# EAGLE design Keg Cop - Daisy Chain T with Slots (EAGLE 9.5.2)
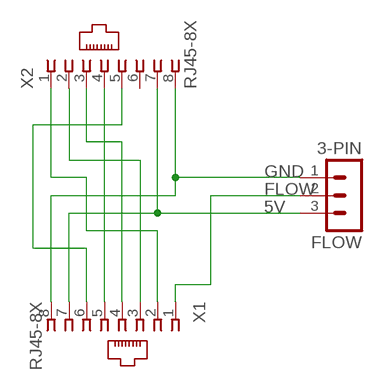
[diagram p0: schematic, sheet 1]

## Parts
FLOW  3-PIN  HDR-3  [HDR-3_VERT]
X1  RJ45-8X  [RJ45-NO-SHIELD]
X2  RJ45-8X  [RJ45-NO-SHIELD]

## Nets
5V: FLOW.3 X1.7 X2.7
FLOW: FLOW.2 X1.1
GND: FLOW.1 X1.8 X2.8
N$1: X1.2 X2.1
N$2: X1.3 X2.2
N$3: X1.4 X2.3
N$5: X1.5 X2.4
N$7: X1.6 X2.5
Unconnected: X2.6

## Library data of the parts
FLOW = Donnie:HDR-3: PIN HEADER
X1 X2 = con-tycoelectronics:RJ45: CORCOM Modular RJ Jacks No Shield Source: www.tycoelectronics.com .. ENG_DS_1654001_1099_RJ_L_0507.pdf; MPN: RJ45-8X; OC_FARNELL: unknown; OC_NEWARK: 16R6101

## Board
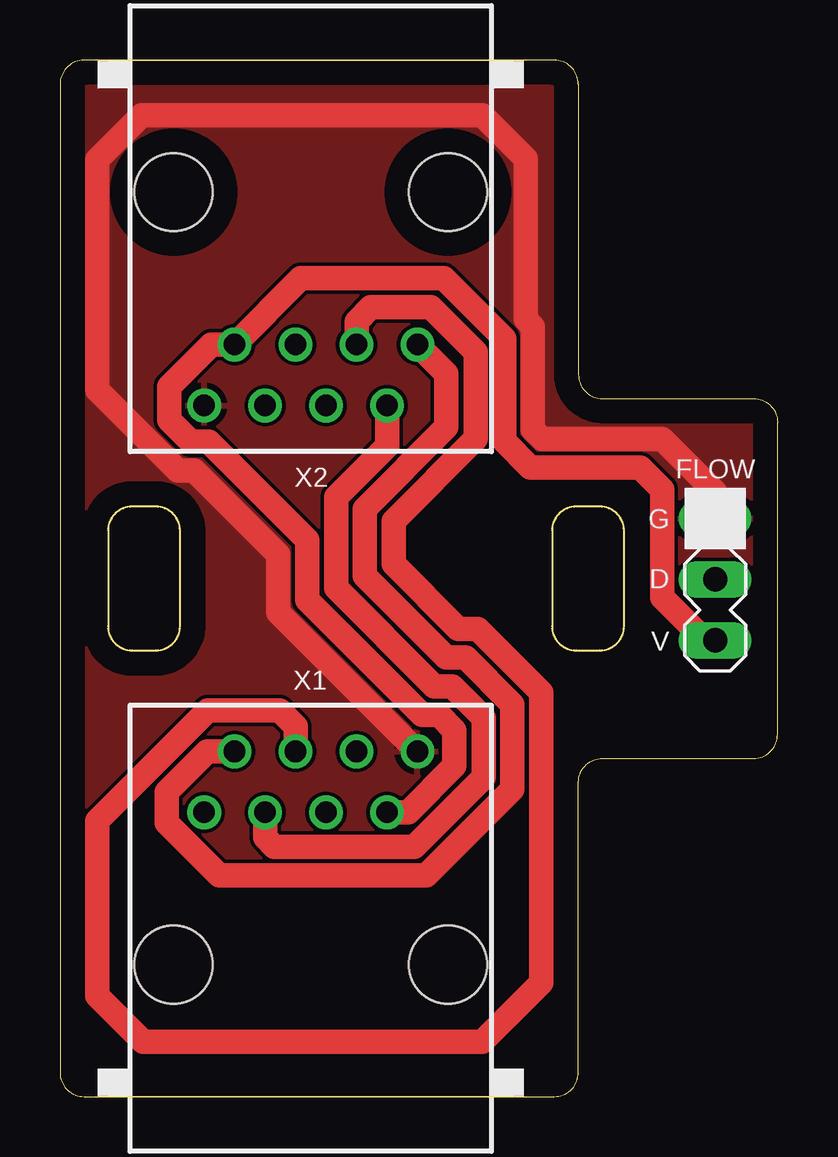
[diagram p1: board, top side]
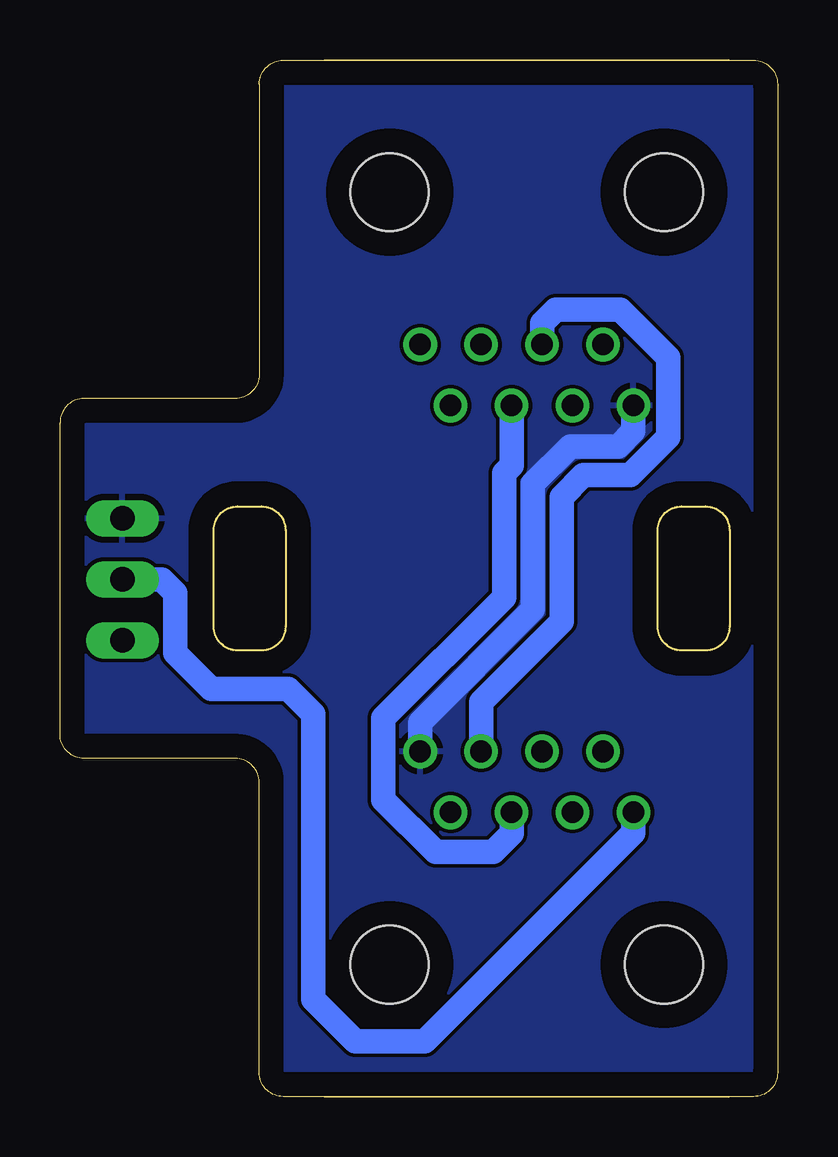
[diagram p2: board, bottom side, seen from below]

Size 29.9 x 43.22 mm. Coordinates in mm from the lower left corner, seen from the top.
Outline: 0,42.21 0,1.01 arc90 1,0.01 20.6,0.01 arc90 21.6,1.01 21.6,13.11 arc-90 22.6,14.11 28.9,14.11 arc90 29.9,15.11 29.9,28.11 arc90 28.9,29.11 22.6,29.11 arc-90 21.6,30.11 21.6,42.21 arc90 20.6,43.21 1,43.21 arc90 0,42.21
Outline: 4,24.61 3,24.61 arc90 2,23.61 2,19.61 arc90 3,18.61 4,18.61 arc90 5,19.61 5,23.61 arc90 4,24.61
Outline: 21.5,18.61 22.5,18.61 arc90 23.5,19.61 23.5,23.61 arc90 22.5,24.61 21.5,24.61 arc90 20.5,23.61 20.5,19.61 arc90 21.5,18.61
Copper layers (1*16): Top 0.035mm / dielectric 1.5mm / Bottom 0.035mm
Design rules "default": minimum track width 6mil, minimum drill 0.35mm, track to track 6mil, track to pad 6mil, pad to pad 6mil, via to via 6mil, smd to smd 6mil, copper to edge 40mil, drill to drill 6mil, minimum pad ring 10mil, minimum via ring 8mil, stop-mask expansion 4mil, vias tented up to drill 0mil, thermal gap 10mil

### Footprints (pad centres in the part's own frame; a part is rotated, then mirrored left to right if it is on the bottom)
HDR-3_VERT = drill 1.016 long: 1 0,0; 2 2.54,0; 3 5.08,0
RJ45-NO-SHIELD = drill 0.9 pad 1.4: 1 -4.445,6.35; 2 -3.175,8.89; 3 -1.905,6.35; 4 -0.635,8.89; 5 0.635,6.35; 6 1.905,8.89; 7 3.175,6.35; 8 4.445,8.89 | hole 3.251: -5.715,0; 5.715,0

### Placement (x,y rotation side)
FLOW  27.3,24.11 270 top
X1  10.45,5.51 0 top
X2  10.45,37.71 180 top

### Tracks (layer width: path | path; a pad name or v marks a point on that pad's centre or on a via)
5V
  Top 1.016: X1.7 14.5,11.86 16.43,13.79 16.43,15.28 15.8,15.91 15.1,15.91 10.3,20.71 10.3,23.21 6.2,27.31 5.45,27.31 4.55,28.21 4.55,29.61 6.3,31.36 X2.7 10.03,34.12 15.99,34.12 18.5,31.61 18.5,27.34 19.6,26.24 24.17,26.24 25.1,25.31 25.1,20.81 26.88,19.03 FLOW.3
FLOW
  Bottom 1.016: X1.1 6,11.01 14.7,2.31 17.59,2.31 19.34,4.07 19.34,15.96 20.4,17.01 23.6,17.01 25.1,18.51 25.1,21.01 25.66,21.57 FLOW.2
GND
  Top 1.016: X1.8 9.1,20.2 9.1,22.62 5.6,26.11 4.9,26.11 1.55,29.46 1.55,39.06 3.4,40.91 17.6,40.91 19.4,39.11 19.4,34.81 19.4,32.41 19.7,32.11 19.7,27.81 20.1,27.41 25.1,27.41 27.3,25.21 FLOW.1
  Bottom 1.016: X2.8 6,27.76 6.65,27.11 8.65,27.11 10.2,25.56 10.2,20.31 14.89,15.62 X1.8
  pour Top: 21.9,43.51 21.9,29.51 30,29.51 30,13.91 21.9,13.91 21.9,-0.29 -0.2,-0.29 -0.2,43.51
  pour Bottom: -0.2,43.51 21.9,43.51 21.9,29.51 30,29.51 30,13.91 21.9,13.91 21.9,-0.29 -0.2,-0.29
N$1
  Top 1.016: X1.2 6.14,14.4 4.45,12.71 4.45,11.41 6.63,9.23 15.27,9.23 18.85,12.81 18.85,16.36 16.9,18.31 16.1,18.31 12.7,21.71 12.7,24.51 16.1,27.91 16.1,30.16 X2.1
N$2
  Top 1.016: X1.3 8.54,10.82 8.93,10.43 14.77,10.43 17.65,13.31 17.65,15.8 16.34,17.11 15.6,17.11 11.5,21.21 11.5,21.91 11.5,25.01 13.62,27.14 X2.2
N$3
  Top 1.016: X2.3 12.36,32.32 12.95,32.91 15.45,32.91 17.32,31.04 17.32,27.44 13.9,24.01 13.9,22.21 16.6,19.51 17.4,19.51 20.05,16.86 20.05,4.75 17.59,2.29 3.46,2.29 1.54,4.21 1.54,11.5 6.15,16.11 9.15,16.11 9.81,15.45 X1.4
N$5
  Bottom 1.016: X1.5 11.09,10.98 11.85,10.21 14.25,10.21 16.43,12.39 16.43,15.79 11.4,20.81 11.4,26.01 11.09,26.33 X2.4
N$7
  Bottom 1.016: X2.5 9.81,32.25 9.25,32.81 6.55,32.81 4.55,30.81 4.55,27.51 6.15,25.91 8.1,25.91 9,25.01 9,19.81 12.36,16.46 X1.6

### Text on the board
tNames: G | D | V